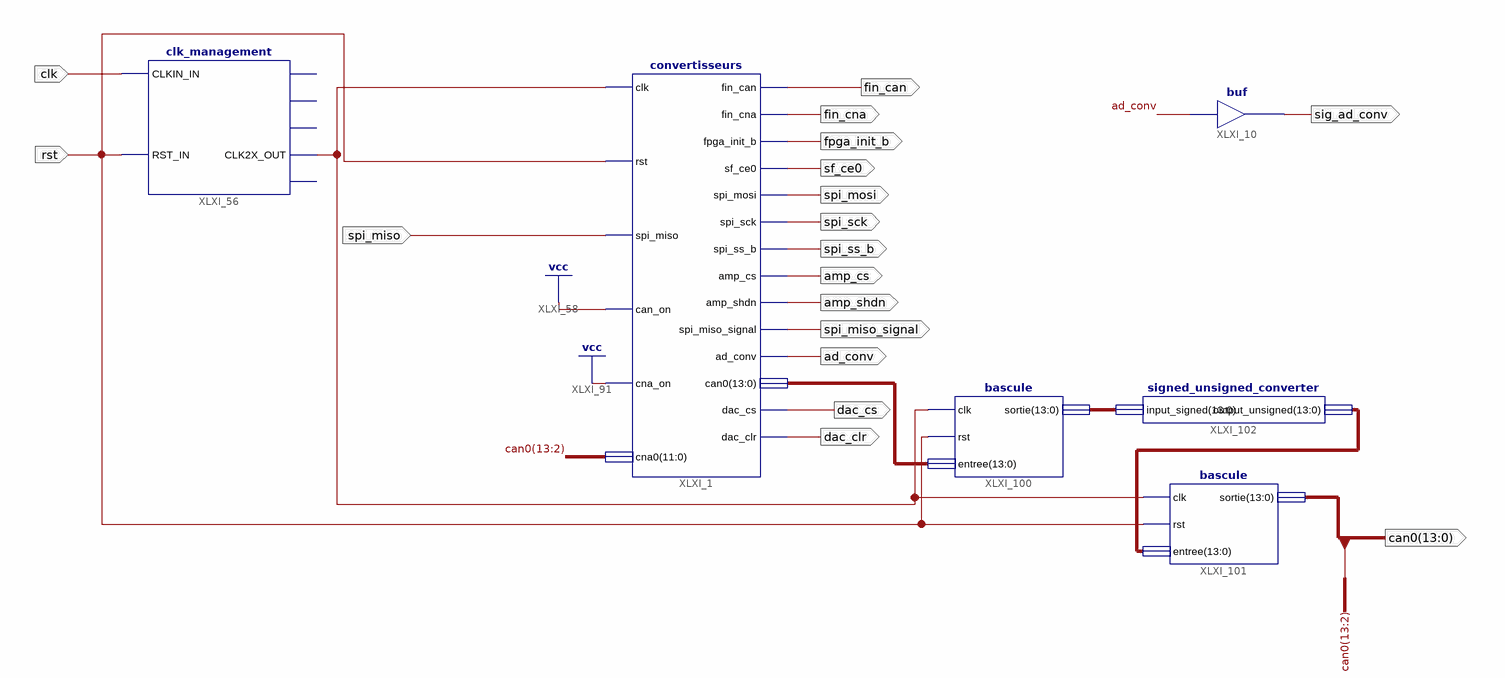
[diagram p0: schematic sheet 1]
// Xilinx ISE schematic Test.sch (spartan3e) as structural Verilog: 6 symbols, 18 ports
module Test (
  input  clk,
  input  rst,
  input  spi_miso,
  output ad_conv,
  output sig_ad_conv,
  output dac_cs,
  output [13:0] can0,
  output fin_cna,
  output fpga_init_b,
  output sf_ce0,
  output spi_mosi,
  output spi_ss_b,
  output amp_cs,
  output amp_shdn,
  output dac_clr,
  output spi_miso_signal,
  output spi_sck,
  output fin_can
);

  wire XLXN_234;
  wire [13:0] XLXN_236, XLXN_237, XLXN_238;

  buf XLXI_10 (sig_ad_conv, ad_conv);
  clk_management XLXI_56 (
    .RST_IN(rst), .CLKIN_IN(clk), .CLK2X_OUT(XLXN_234));  // open: CLKFX_OUT, CLK2X180_OUT, CLKIN_IBUFG_OUT, CLK0_OUT
  bascule XLXI_100 (.clk(XLXN_234), .rst(rst), .entree(XLXN_237), .sortie(XLXN_236));
  bascule XLXI_101 (.clk(XLXN_234), .rst(rst), .entree(XLXN_238), .sortie(can0));
  signed_unsigned_converter XLXI_102 (.input_signed(XLXN_236), .output_unsigned(XLXN_238));
  convertisseurs XLXI_1 (
    .clk(XLXN_234), .rst(rst), .spi_miso(spi_miso), .can_on(1'b1), .cna_on(1'b1), .cna0(can0[13:2]),
    .fin_can(fin_can), .fin_cna(fin_cna), .fpga_init_b(fpga_init_b), .sf_ce0(sf_ce0), .spi_mosi(spi_mosi),
    .spi_sck(spi_sck), .spi_ss_b(spi_ss_b), .amp_cs(amp_cs), .amp_shdn(amp_shdn),
    .spi_miso_signal(spi_miso_signal), .ad_conv(ad_conv), .can0(XLXN_237), .dac_cs(dac_cs), .dac_clr(dac_clr));
endmodule
